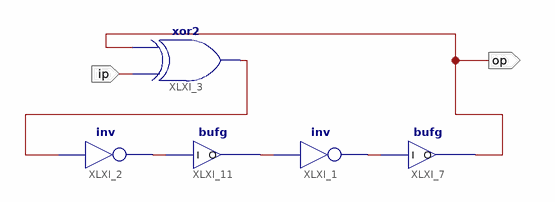
[diagram p0: schematic sheet 1]
// Xilinx ISE schematic osc_test1.sch (spartan3e) as structural Verilog: 5 symbols, 2 ports
module osc_test1 (
  input  ip,
  output op
);

  wire XLXN_1, XLXN_6, XLXN_8, XLXN_9;

  not XLXI_1 (XLXN_9, XLXN_8);
  not XLXI_2 (XLXN_6, XLXN_1);
  xor XLXI_3 (XLXN_1, ip, op);
  bufg XLXI_7 (.I(XLXN_9), .O(op));
  bufg XLXI_11 (.I(XLXN_6), .O(XLXN_8));
endmodule
